# EAGLE schematic P-LED-0004-V1A EAGLE Schematic (EAGLE 9.7.0)
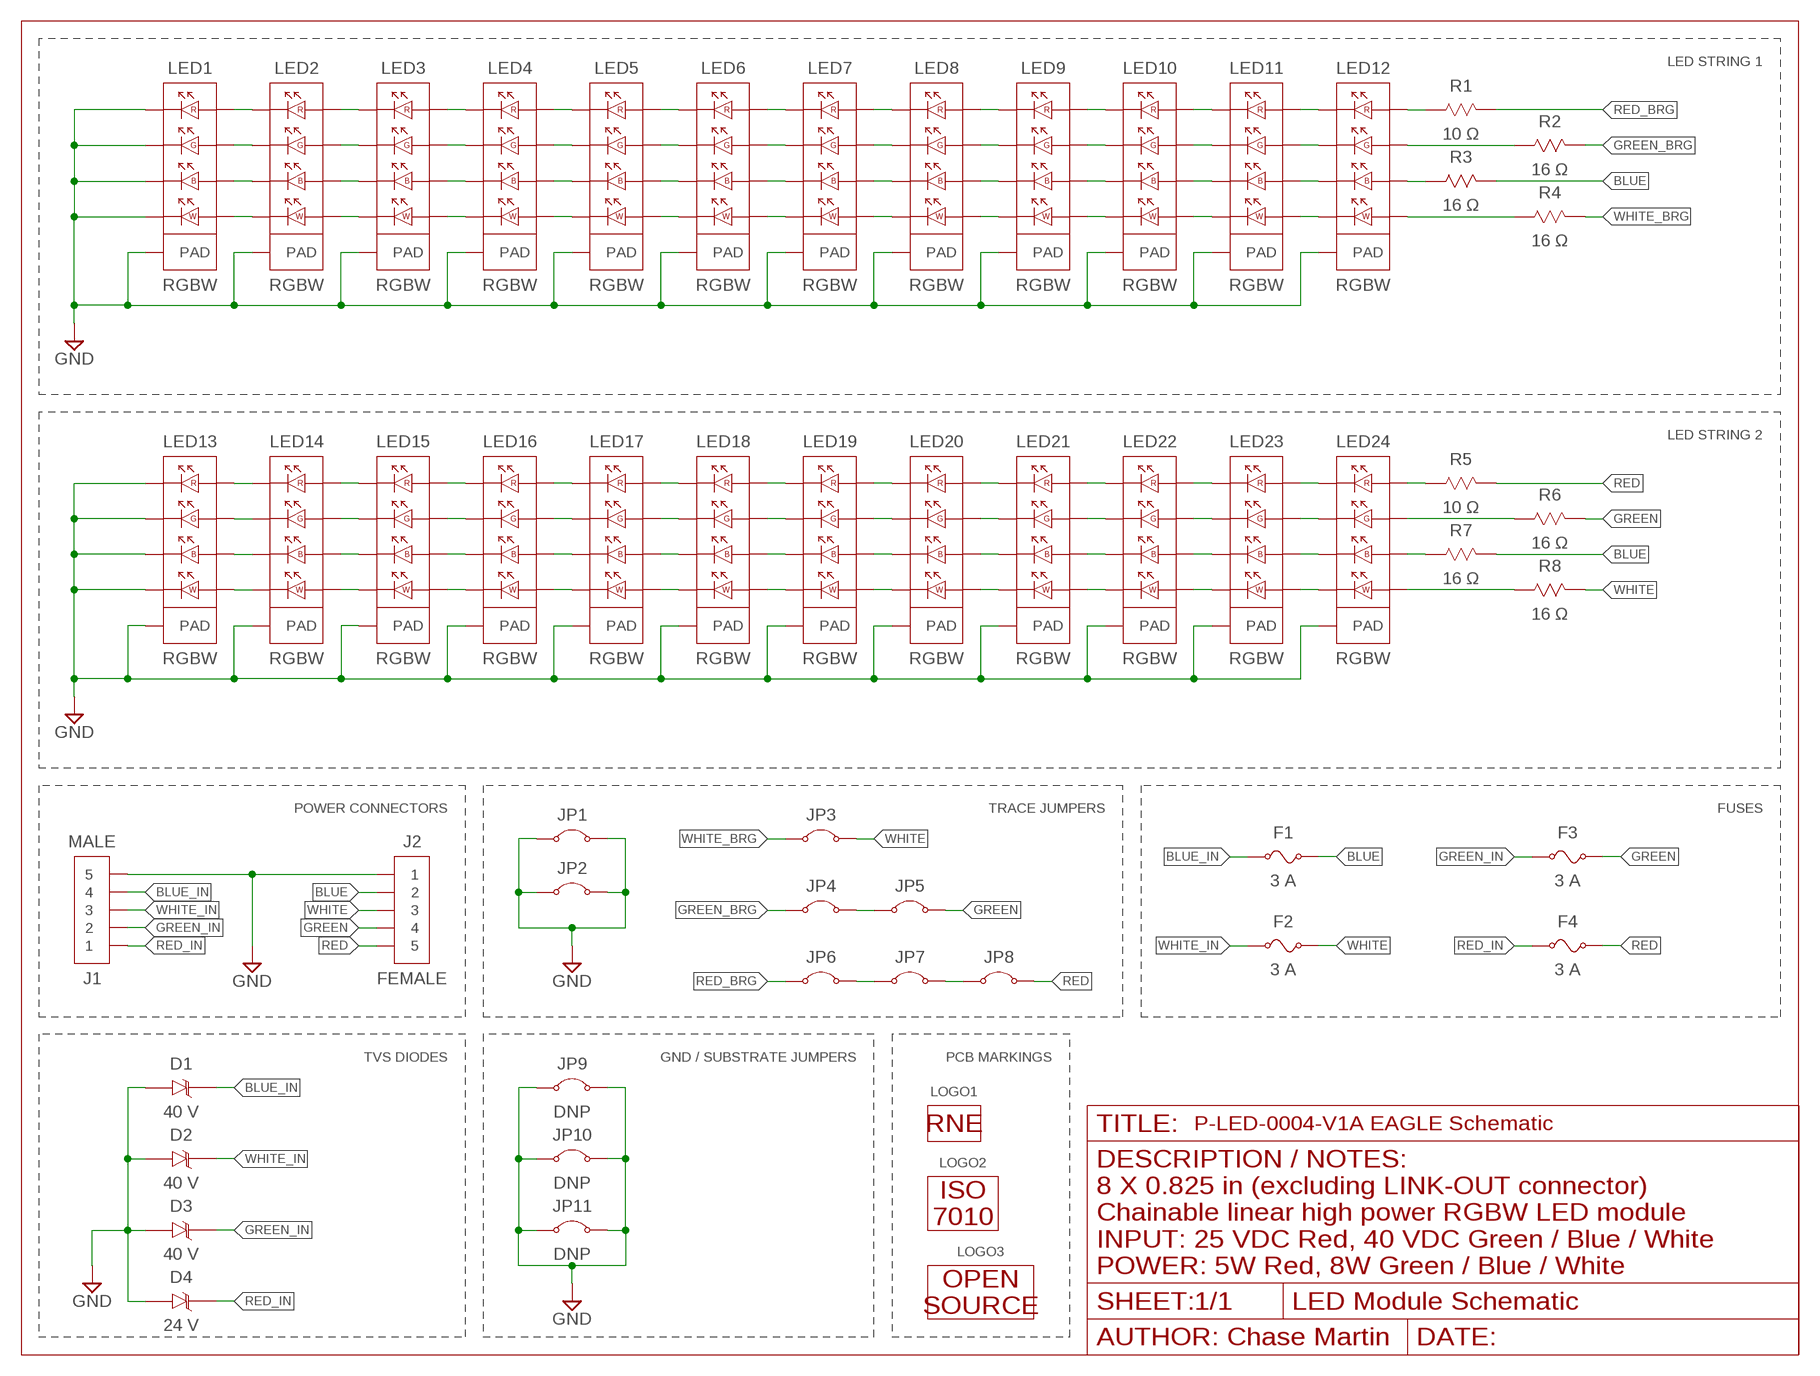
[diagram p0: schematic, sheet 1]

## Parts
D1  40 V  UNIDIRECTIONAL_TVS_DIODESMD_0603  [0603_POLARIZED]
D2  40 V  UNIDIRECTIONAL_TVS_DIODESMD_0603  [0603_POLARIZED]
D3  40 V  UNIDIRECTIONAL_TVS_DIODESMD_0603  [0603_POLARIZED]
D4  24 V  UNIDIRECTIONAL_TVS_DIODESMD_0603  [0603_POLARIZED]
F1  3 A  FUSESMD_1206  [1206]
F2  3 A  FUSESMD_1206  [1206]
F3  3 A  FUSESMD_1206  [1206]
F4  3 A  FUSESMD_1206  [1206]
J1  MALE  5-PIN_1-ROWMALE_SMD_HORIZONTAL  [5-PIN_1-ROW_MALE_SMD_HORIZONTAL]
J2  FEMALE  5-PIN_1-ROWFEMALE_SMD_HORIZONTAL  [5-PIN_1-ROW_FEMALE_SMD_HORIZONTAL]
JP1  JUMPERSMD_1206  [1206]
JP2  JUMPERSMD_1206  [1206]
JP3  JUMPERSMD_1206  [1206]
JP4  JUMPERSMD_1206  [1206]
JP5  JUMPERSMD_1206  [1206]
JP6  JUMPERSMD_1206  [1206]
JP7  JUMPERSMD_1206  [1206]
JP8  JUMPERSMD_1206  [1206]
JP9  DNP  JUMPERSMD_0603  [0603]
JP10  DNP  JUMPERSMD_0603  [0603]
JP11  DNP  JUMPERSMD_0603  [0603]
LED1  RGBW  IN-P55QSTGRGBWAIS  [IN-P55QSTGRGBW_AIS]
LED2  RGBW  IN-P55QSTGRGBWAIS  [IN-P55QSTGRGBW_AIS]
LED3  RGBW  IN-P55QSTGRGBWAIS  [IN-P55QSTGRGBW_AIS]
LED4  RGBW  IN-P55QSTGRGBWAIS  [IN-P55QSTGRGBW_AIS]
LED5  RGBW  IN-P55QSTGRGBWAIS  [IN-P55QSTGRGBW_AIS]
LED6  RGBW  IN-P55QSTGRGBWAIS  [IN-P55QSTGRGBW_AIS]
LED7  RGBW  IN-P55QSTGRGBWAIS  [IN-P55QSTGRGBW_AIS]
LED8  RGBW  IN-P55QSTGRGBWAIS  [IN-P55QSTGRGBW_AIS]
LED9  RGBW  IN-P55QSTGRGBWAIS  [IN-P55QSTGRGBW_AIS]
LED10  RGBW  IN-P55QSTGRGBWAIS  [IN-P55QSTGRGBW_AIS]
LED11  RGBW  IN-P55QSTGRGBWAIS  [IN-P55QSTGRGBW_AIS]
LED12  RGBW  IN-P55QSTGRGBWAIS  [IN-P55QSTGRGBW_AIS]
LED13  RGBW  IN-P55QSTGRGBWAIS  [IN-P55QSTGRGBW_AIS]
LED14  RGBW  IN-P55QSTGRGBWAIS  [IN-P55QSTGRGBW_AIS]
LED15  RGBW  IN-P55QSTGRGBWAIS  [IN-P55QSTGRGBW_AIS]
LED16  RGBW  IN-P55QSTGRGBWAIS  [IN-P55QSTGRGBW_AIS]
LED17  RGBW  IN-P55QSTGRGBWAIS  [IN-P55QSTGRGBW_AIS]
LED18  RGBW  IN-P55QSTGRGBWAIS  [IN-P55QSTGRGBW_AIS]
LED19  RGBW  IN-P55QSTGRGBWAIS  [IN-P55QSTGRGBW_AIS]
LED20  RGBW  IN-P55QSTGRGBWAIS  [IN-P55QSTGRGBW_AIS]
LED21  RGBW  IN-P55QSTGRGBWAIS  [IN-P55QSTGRGBW_AIS]
LED22  RGBW  IN-P55QSTGRGBWAIS  [IN-P55QSTGRGBW_AIS]
LED23  RGBW  IN-P55QSTGRGBWAIS  [IN-P55QSTGRGBW_AIS]
LED24  RGBW  IN-P55QSTGRGBWAIS  [IN-P55QSTGRGBW_AIS]
LOGO1  PROFILE_LOGO_RNE0.375"  [RNE_PROFILE-LOGO_375]
LOGO2  HOT_SURFACE_ISO0.375"_LABEL  [ISO_HOT-SURFACE_375_LABEL]
LOGO3  OPEN_SOURCE_OSHWA0.375"_LABEL  [OSHWA_OPEN-SOURCE_375_LABEL]
R1  10 Ω  RESISTORSMD_0603  [0603]
R2  16 Ω  RESISTORSMD_0603  [0603]
R3  16 Ω  RESISTORSMD_0603  [0603]
R4  16 Ω  RESISTORSMD_0603  [0603]
R5  10 Ω  RESISTORSMD_0603  [0603]
R6  16 Ω  RESISTORSMD_0603  [0603]
R7  16 Ω  RESISTORSMD_0603  [0603]
R8  16 Ω  RESISTORSMD_0603  [0603]

## Nets
B1_RESISTOR [LED String]: LED12.BLUE_P R3.1
B2_RESISTOR [LED String]: LED24.BLUE_P R7.1
B_12 [LED String]: LED1.BLUE_P LED2.BLUE_N
B_23 [LED String]: LED2.BLUE_P LED3.BLUE_N
B_34 [LED String]: LED3.BLUE_P LED4.BLUE_N
B_45 [LED String]: LED4.BLUE_P LED5.BLUE_N
B_56 [LED String]: LED5.BLUE_P LED6.BLUE_N
B_67 [LED String]: LED6.BLUE_P LED7.BLUE_N
B_78 [LED String]: LED7.BLUE_P LED8.BLUE_N
B_89 [LED String]: LED8.BLUE_P LED9.BLUE_N
B_910 [LED String]: LED9.BLUE_P LED10.BLUE_N
B_1011 [LED String]: LED10.BLUE_P LED11.BLUE_N
B_1112 [LED String]: LED11.BLUE_P LED12.BLUE_N
B_1314 [LED String]: LED13.BLUE_P LED14.BLUE_N
B_1415 [LED String]: LED14.BLUE_P LED15.BLUE_N
B_1516 [LED String]: LED15.BLUE_P LED16.BLUE_N
B_1617 [LED String]: LED16.BLUE_P LED17.BLUE_N
B_1718 [LED String]: LED17.BLUE_P LED18.BLUE_N
B_1819 [LED String]: LED18.BLUE_P LED19.BLUE_N
B_1920 [LED String]: LED19.BLUE_P LED20.BLUE_N
B_2021 [LED String]: LED20.BLUE_P LED21.BLUE_N
B_2122 [LED String]: LED21.BLUE_P LED22.BLUE_N
B_2223 [LED String]: LED22.BLUE_P LED23.BLUE_N
B_2324 [LED String]: LED23.BLUE_P LED24.BLUE_N
BLUE [High Power]: F1.2 J2.2 R3.2 R7.2
BLUE_IN [High Power]: D1.K F1.1 J1.4
G1_RESISTOR [LED String]: LED12.GREEN_P R2.1
G2_RESISTOR [LED String]: LED24.GREEN_P R6.1
G_12 [LED String]: LED1.GREEN_P LED2.GREEN_N
G_23 [LED String]: LED2.GREEN_P LED3.GREEN_N
G_34 [LED String]: LED3.GREEN_P LED4.GREEN_N
G_45 [LED String]: LED4.GREEN_P LED5.GREEN_N
G_56 [LED String]: LED5.GREEN_P LED6.GREEN_N
G_67 [LED String]: LED6.GREEN_P LED7.GREEN_N
G_78 [LED String]: LED7.GREEN_P LED8.GREEN_N
G_89 [LED String]: LED8.GREEN_P LED9.GREEN_N
G_910 [LED String]: LED9.GREEN_P LED10.GREEN_N
G_1011 [LED String]: LED10.GREEN_P LED11.GREEN_N
G_1112 [LED String]: LED11.GREEN_P LED12.GREEN_N
G_1314 [LED String]: LED13.GREEN_P LED14.GREEN_N
G_1415 [LED String]: LED14.GREEN_P LED15.GREEN_N
G_1516 [LED String]: LED15.GREEN_P LED16.GREEN_N
G_1617 [LED String]: LED16.GREEN_P LED17.GREEN_N
G_1718 [LED String]: LED17.GREEN_P LED18.GREEN_N
G_1819 [LED String]: LED18.GREEN_P LED19.GREEN_N
G_1920 [LED String]: LED19.GREEN_P LED20.GREEN_N
G_2021 [LED String]: LED20.GREEN_P LED21.GREEN_N
G_2122 [LED String]: LED21.GREEN_P LED22.GREEN_N
G_2223 [LED String]: LED22.GREEN_P LED23.GREEN_N
G_2324 [LED String]: LED23.GREEN_P LED24.GREEN_N
GND [High Power]: D1.A D2.A D3.A D4.A J1.5 J2.1 JP1.1 JP1.2 JP2.1 JP2.2 JP9.1 JP9.2 JP10.1 JP10.2 JP11.1 JP11.2 LED1.BLUE_N LED1.GREEN_N LED1.PAD LED1.RED_N LED1.WHITE_N LED2.PAD LED3.PAD LED4.PAD LED5.PAD LED6.PAD LED7.PAD LED8.PAD LED9.PAD LED10.PAD LED11.PAD LED12.PAD LED13.BLUE_N LED13.GREEN_N LED13.PAD LED13.RED_N LED13.WHITE_N LED14.PAD LED15.PAD LED16.PAD LED17.PAD LED18.PAD LED19.PAD LED20.PAD LED21.PAD LED22.PAD LED23.PAD LED24.PAD
GREEN [High Power]: F3.2 J2.4 JP5.2 R6.2
GREEN_BRG [High Power]: JP4.1 R2.2
GREEN_BRG_2 [High Power]: JP4.2 JP5.1
GREEN_IN [High Power]: D3.K F3.1 J1.2
R1_RESISTOR [LED String]: LED12.RED_P R1.1
R2_RESISTOR [LED String]: LED24.RED_P R5.1
R_12 [LED String]: LED1.RED_P LED2.RED_N
R_23 [LED String]: LED2.RED_P LED3.RED_N
R_34 [LED String]: LED3.RED_P LED4.RED_N
R_45 [LED String]: LED4.RED_P LED5.RED_N
R_56 [LED String]: LED5.RED_P LED6.RED_N
R_67 [LED String]: LED6.RED_P LED7.RED_N
R_78 [LED String]: LED7.RED_P LED8.RED_N
R_89 [LED String]: LED8.RED_P LED9.RED_N
R_910 [LED String]: LED9.RED_P LED10.RED_N
R_1011 [LED String]: LED10.RED_P LED11.RED_N
R_1112 [LED String]: LED11.RED_P LED12.RED_N
R_1314 [LED String]: LED13.RED_P LED14.RED_N
R_1415 [LED String]: LED14.RED_P LED15.RED_N
R_1516 [LED String]: LED15.RED_P LED16.RED_N
R_1617 [LED String]: LED16.RED_P LED17.RED_N
R_1718 [LED String]: LED17.RED_P LED18.RED_N
R_1819 [LED String]: LED18.RED_P LED19.RED_N
R_1920 [LED String]: LED19.RED_P LED20.RED_N
R_2021 [LED String]: LED20.RED_P LED21.RED_N
R_2122 [LED String]: LED21.RED_P LED22.RED_N
R_2223 [LED String]: LED22.RED_P LED23.RED_N
R_2324 [LED String]: LED23.RED_P LED24.RED_N
RED [High Power]: F4.2 J2.5 JP8.2 R5.2
RED_BRG [High Power]: JP6.1 R1.2
RED_BRG_2 [High Power]: JP6.2 JP7.1
RED_BRG_3 [High Power]: JP7.2 JP8.1
RED_IN [High Power]: D4.K F4.1 J1.1
W1_RESISTOR [LED String]: LED12.WHITE_P R4.1
W2_RESISTOR [LED String]: LED24.WHITE_P R8.1
W_12 [LED String]: LED1.WHITE_P LED2.WHITE_N
W_23 [LED String]: LED2.WHITE_P LED3.WHITE_N
W_34 [LED String]: LED3.WHITE_P LED4.WHITE_N
W_45 [LED String]: LED4.WHITE_P LED5.WHITE_N
W_56 [LED String]: LED5.WHITE_P LED6.WHITE_N
W_67 [LED String]: LED6.WHITE_P LED7.WHITE_N
W_78 [LED String]: LED7.WHITE_P LED8.WHITE_N
W_89 [LED String]: LED8.WHITE_P LED9.WHITE_N
W_910 [LED String]: LED9.WHITE_P LED10.WHITE_N
W_1011 [LED String]: LED10.WHITE_P LED11.WHITE_N
W_1112 [LED String]: LED11.WHITE_P LED12.WHITE_N
W_1314 [LED String]: LED13.WHITE_P LED14.WHITE_N
W_1415 [LED String]: LED14.WHITE_P LED15.WHITE_N
W_1516 [LED String]: LED15.WHITE_P LED16.WHITE_N
W_1617 [LED String]: LED16.WHITE_P LED17.WHITE_N
W_1718 [LED String]: LED17.WHITE_P LED18.WHITE_N
W_1819 [LED String]: LED18.WHITE_P LED19.WHITE_N
W_1920 [LED String]: LED19.WHITE_P LED20.WHITE_N
W_2021 [LED String]: LED20.WHITE_P LED21.WHITE_N
W_2122 [LED String]: LED21.WHITE_P LED22.WHITE_N
W_2223 [LED String]: LED22.WHITE_P LED23.WHITE_N
W_2324 [LED String]: LED23.WHITE_P LED24.WHITE_N
WHITE [High Power]: F2.2 J2.3 JP3.2 R8.2
WHITE_BRG [High Power]: JP3.1 R4.2
WHITE_IN [High Power]: D2.K F2.1 J1.3

## Notes on the sheet
- LED STRING 1
- LED STRING 2
- POWER CONNECTORS | TRACE JUMPERS | FUSES
- TVS DIODES | GND / SUBSTRATE JUMPERS | PCB MARKINGS
- 8 X 0.825 in (excluding LINK-OUT connector)
  Chainable linear high power RGBW LED module
  INPUT: 25 VDC Red, 40 VDC Green / Blue / White
  POWER: 5W Red, 8W Green / Blue / White

## Library data of the parts
D1-D4 = Standard Passive Components:UNIDIRECTIONAL_TVS_DIODE
F1-F4 = Standard Passive Components:FUSE
J1 J2 = Pin Header Connectors:5-PIN_1-ROW: 5 pin, 1 row 0.1" (2.54 mm) pin header; various genders, form factors, and mounting methods
JP1-JP11 = Standard Passive Components:JUMPER
LED1-LED24 = Specialty LEDs:IN-P55QSTGRGBW: The IN-P55QSTGRGBW is PLCC8 Slug 0.5w RGBW LED. It is a SMD type LED which can be used in various applications.
LOGO1 = Silkscreen Markings:PROFILE_LOGO_RNE: Rainbowneck Engineering identification symbol: RNE Profile Logo.
LOGO2 = Silkscreen Markings:HOT_SURFACE_ISO: ISO 7010 warning symbol W017: Hot Surface.
LOGO3 = Silkscreen Markings:OPEN_SOURCE_OSHWA: OSHWA identification symbol: Open Source Hardware.
R1-R8 = Standard Passive Components:RESISTOR